# Altium schematic sheet interface.SchDoc
size A; SheetNumber: 2; SheetTotal: 4
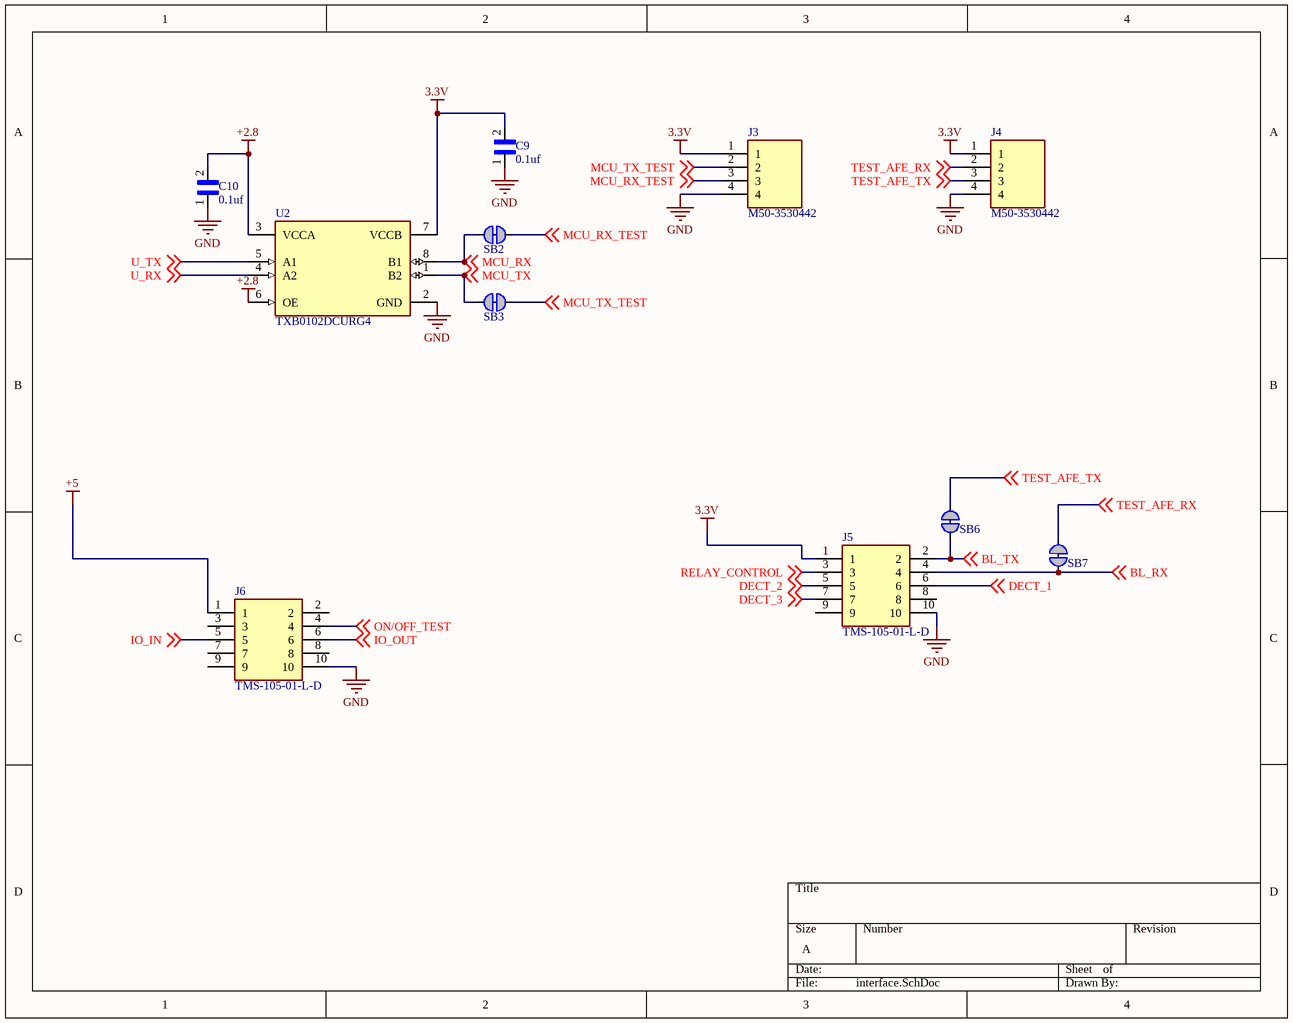
[diagram p0: interface.SchDoc]

## Parts
C9  value 0.1uf  [CAPC1608X90N]
C10  value 0.1uf  [CAPC1608X90N]
J3  M50-3530442  [HDRV4W40P0X127_1X4_508X210X420P]
J4  M50-3530442  [HDRV4W40P0X127_1X4_508X210X420P]
J5  TMS-105-01-L-D  [HDRV10W51P254X127_2X5_635X498X838P]
J6  TMS-105-01-L-D  [HDRV10W51P254X127_2X5_635X498X838P]
SB2  Solderbridge  [SOLDERBRIDGE_SHORTED]  (value not drawn)  (net tie, no BOM)
SB3  Solderbridge  [SOLDERBRIDGE_SHORTED]  (value not drawn)  (net tie, no BOM)
SB6  Solderbridge  [SOLDERBRIDGE_SHORTED]  (value not drawn)  (net tie, no BOM)
SB7  Solderbridge  [SOLDERBRIDGE_SHORTED]  (value not drawn)  (net tie, no BOM)
U2  TXB0102DCURG4  [SOP50P310X90-8N]

## Nets
3.3V: C9.2 J3.1 J4.1 J5.1 U2.7(VCCB)
+2.8: C10.2 U2.3(VCCA) U2.6(OE)
+5: J6.1
GND: C9.1 C10.1 J3.4 J4.4 J5.10 J6.10 U2.2(GND)
BL_RX: J5.4 SB7.2 ; off-sheet BL_RX
BL_TX: J5.2 SB6.1 ; off-sheet BL_TX
DECT_1: J5.6 ; off-sheet DECT_1
DECT_2: J5.5 ; off-sheet DECT_2
DECT_3: J5.7 ; off-sheet DECT_3
IO_IN: J6.5 ; off-sheet IO_IN
IO_OUT: J6.6 ; off-sheet IO_OUT
MCU_RX: SB2.2 U2.8(B1) ; off-sheet MCU_RX
MCU_RX_TEST: J3.3 SB2.1 ; off-sheet MCU_RX_TEST
MCU_TX: SB3.2 U2.1(B2) ; off-sheet MCU_TX
MCU_TX_TEST: J3.2 SB3.1 ; off-sheet MCU_TX_TEST
ON/OFF_TEST: J6.4 ; off-sheet ON/OFF_TEST
RELAY_CONTROL: J5.3 ; off-sheet RELAY_CONTROL
TEST_AFE_RX: J4.2 SB7.1 ; off-sheet TEST_AFE_RX
TEST_AFE_TX: J4.3 SB6.2 ; off-sheet TEST_AFE_TX
U_RX: U2.4(A2) ; off-sheet U_RX
U_TX: U2.5(A1) ; off-sheet U_TX

Not connected (* = marked no-connect by the designer): J5 8 9; J6 2 3 7 8 9

## Library data of the parts
C9 C10 = 06033G104ZAT4A: Cap Ceramic 0.1uF 25V Y5V -20% to 80% SMD 0603 85C T/R; MF: {'manufacturer': u'AVX'}; Availability: Unavailable; MP: 06033G104ZAT4A; Price: None; Package: None
J3 J4 = M50-3530442: Connector; Manufacturer_Name: Harwin; Datasheet Link: https://cdn.harwin.com/pdfs/M50-353.pdf; Height: 4.2mm; Manufacturer_Part_Number: M50-3530442; Mouser Part Number: 855-M50-3530442; Mouser Price/Stock: https://www.mouser.co.uk/ProductDetail/Harwin/M50-3530442?qs=%252BdQmOuGyFcH%2FaHqroeU8Uw%3D%3D
J5 J6 = TMS-105-01-L-D: Connector; Manufacturer_Name: SAMTEC; Datasheet Link: http://suddendocs.samtec.com/catalog_english/tms_th.pdf; Height: 8.38mm; Manufacturer_Part_Number: TMS-105-01-L-D; Mouser Part Number: 200-TMS10501LD; Mouser Price/Stock: https://www.mouser.com/Search/Refine.aspx?Keyword=200-TMS10501LD; Arrow Part Number: TMS-105-01-L-D; Arrow Price/Stock: https://www.arrow.com/en/products/tms-105-01-l-d/samtec
SB2 SB3 SB6 SB7 = SOLDERBRIDGE_SHORTED: Shorted Solderbridge; Part Number: Solderbridge Shorted; Artikkelnr Noca: N.A.; Manufacturer: *; Manufacturer Part Number: *; Datasheet: *; LatestRevisionDate: 2012-08-07; Pin Count: 2; Publisher: Nordic Semiconductor; Published: 2012-08-07; Value: Solderbridge; Note: *; Supplier: *; Supplier part number: *; 2nd source Supplier: *; 2nd source part number: *; Footprint Doc: Solderbridge_Shorted; Artikkelnr Simpro: N.A.
U2 = e5aacda1e23edf748dee3cec588ab45: IC TRNSLTR BIDIRECTIONAL US8; Low Level Output Current: 20uA; Number of Channels: 2; Turn-On Delay Time: 7.4ns; Propagation Delay: 31ns; High Level Output Current: -20uA; Min Supply Voltage: 1.2V; Data Rate: 100Mbps; Logic Function: Translator; Output Type: 3-STATE; Max Supply Voltage: 5.5V; Lead Free: Contains Lead; Max Operating Temperature: 85°C; Number of Pins: 8; Number of Bits: 2; Case/Package: VSSOP; Radiation Hardening: No; Min Operating Temperature: -40°C; RoHS Compliant: Yes; Series: -; Mount: Surface Mount; Package Quantity: 3000; Weight: 0.000339oz; Packaging: Tape and Reel